# Altium schematic sheet Connections.SchDoc
size A4
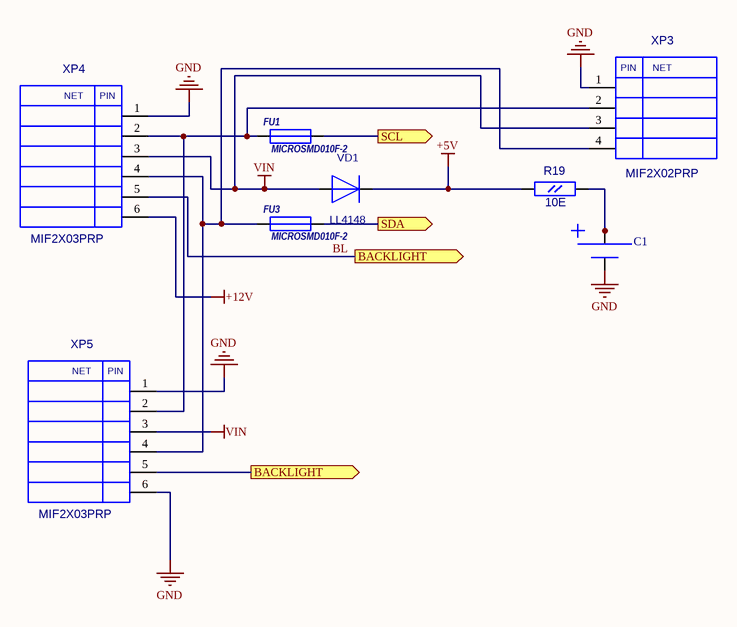
[diagram p0: Connections.SchDoc]

## Parts
C1  EEC-S5R5H105  [CR2032_ONBOARD]  (value not drawn)
FU1  MICROSMD010F-2  [RC1210]
FU3  MICROSMD010F-2  [RC1210]
R19  10E  [RC0603]
VD1  LL4148  [SOD-80]
XP3  MIF2X02PRP  [MIF2X02PRP]
XP4  MIF2X03PRP  [MIF2X03PRP]
XP5  MIF2X03PRP  [MIF2X03PRP]

## Ports
BACKLIGHT (out), SCL (out), SDA (out)

## Nets
+5V: R19.1(A) VD1.2(+)
+12V: XP4.6
GND: C1.1 XP3.1 XP4.1 XP5.1 XP5.6
VIN: VD1.1(-) XP3.3 XP4.3 XP5.3
BL: XP4.5 XP5.5 ; port BACKLIGHT
SCL: FU1.2 ; port SCL
SDA: FU3.2 ; port SDA
NetC1_2: C1.2 C1.3 C1.4 R19.2(B)
NetFU1_1: FU1.1 XP3.2 XP4.2 XP5.2
NetFU3_1: FU3.1 XP3.4 XP4.4 XP5.4

## Notes on the sheet
- (in symbol MIF2X02PRP) PIN; NET
- (in symbol MIF2X03PRP) NET; PIN

## Library data of the parts
C1 = CR2032-VBY2: Value: EEC-S5R5H105
FU1 FU3 = MICROSMD: Value: MICROSMD010F-2
R19 = RC0603: Value: 10E
VD1 = LL4148: Value: *
XP3 = MIF2X02PRP: Value: MIF2X02PRP
XP4 XP5 = MIF2X03PRP: Value: *